# EAGLE design schematic (EAGLE 7.4.0)
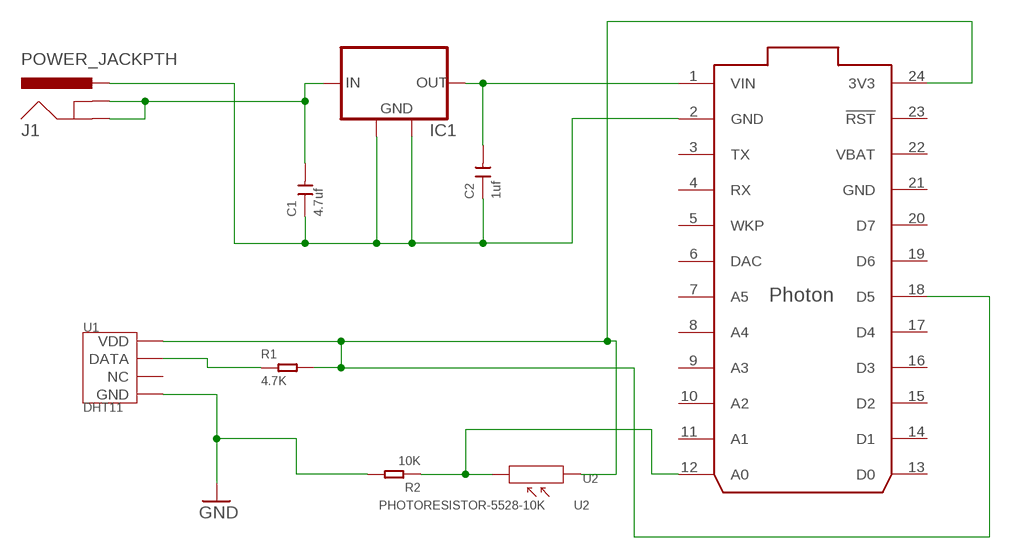
[diagram p0: schematic, sheet 1]

## Parts
C1  4.7uf  CERAMIC-4.7UF-50V-10%-X5R(1206)  [C1206]
C2  1uf  CERAMIC-1UF-25V-10%-X7R(0805)  [C0805]
IC1  MCP1825S-SOT223  [SOT223]
J1  POWER_JACKPTH  [POWER_JACK_PTH]
R1  4.7K  DIP-RES-4.7K-5%-1/4W(PR-D2.3XL6.5MM)  [PR-D2.3XL6.5MM]
R2  10K  DIP-RES-10K-5%-1/4W(PR-D2.3XL6.5MM)  [PR-D2.3XL6.5MM]
U1  DHT11  TEM-HUM-DHT11(4P-15.5X12.0MM)  [SNR4-2.54-15.5X12.0X5.5MM]
U2  PHOTORESISTOR-5528-10K  PHOTORESISTOR-5528-10K(2P-5.0X4.2MM)  [SNR2-3.0]
U$1  PHOTON_SMD  [PHOTON_SMD]

## Nets
GND: R2.2 U1.4(GND)
N$1: C1.1 C2.1 IC1.2(GND) IC1.4(GND) J1.PWR U$1.2(GND)
N$2: R1.1 U1.2(DATA)
N$4: C1.2 IC1.1(IN) J1.GND J1.GNDBREAK
N$5: C2.2 IC1.3(OUT) U$1.1(VIN)
N$8: R2.1 U2.2 U$1.12(A0)
VDD: R1.2 U1.1(VDD) U2.1 U$1.18(D5) U$1.24(3V3)
Unconnected: U1.3(NC) U$1.3(TX) U$1.4(RX) U$1.5(WKP) U$1.6(DAC) U$1.7(A5) U$1.8(A4) U$1.9(A3) U$1.10(A2) U$1.11(A1) U$1.13(D0) U$1.14(D1) U$1.15(D2) U$1.16(D3) U$1.17(D4) U$1.19(D6) U$1.20(D7) U$1.23(!RST) U$1.25(EN) U$1.26(!SETUP) U$1.27(RGB_RED) U$1.28(RGB_GREEN) U$1.29(RGB_BLUE) U$1.30(USB_D-) U$1.31(USB_D+)

## Power pins joined to a net without a drawn wire
GND: U$1.21(GND)
VBAT: U$1.22(VBAT)

## Library data of the parts
C1 = Seeed-OPL-Capacitor:CERAMIC-4.7UF-50V-10%-X5R(1206): 302010243; MPN: CC1206KKX5R9BB475
C2 = Seeed-OPL-Capacitor:CERAMIC-1UF-25V-10%-X7R(0805): 302010179; MPN: CC0805KKX7R8BB105
IC1 = Spark:MCP1825S: 500 mA, Low Voltage, Low Quiescent Current LDO Regulator
J1 = Spark:POWER_JACK: Power Jack This is the standard 5.5mm barrel jack for power. The PTH is the most common, proven, reliable, footprint. The Slot footprint only works if the mill layer is transmitted to the PCB fab house so be warned. Spark Fun Electronics SKU : PRT-00119 SMT: CONN-08106 Mating wall wart : TOL-00298 (and others)
R1 = Seeed-OPL-Resistor:DIP-RES-4.7K-5%-1/4W(PR-D2.3XL6.5MM): 301020012; MPN: FHCFR-1/4W-472J
R2 = Seeed-OPL-Resistor:DIP-RES-10K-5%-1/4W(PR-D2.3XL6.5MM): 301020001
U1 = Seeed-OPL-sensor:TEM-HUM-DHT11(4P-15.5X12.0MM): 314010000; MPN: DHT11
U2 = Seeed-OPL-sensor:PHOTORESISTOR-5528-10K(2P-5.0X4.2MM): 314020017; MPN: PHOTORESISTOR-5528-10K
U$1 = Spark:PHOTON_SMD: Photon (without headers) - designed to be surface mounted with 7 extra exposed pads on the bottom of the board which include, 3 RGB LED outputs, /SETUP, EN (3.3V SMPS enable input), USB D+ and USB D-.

## Board
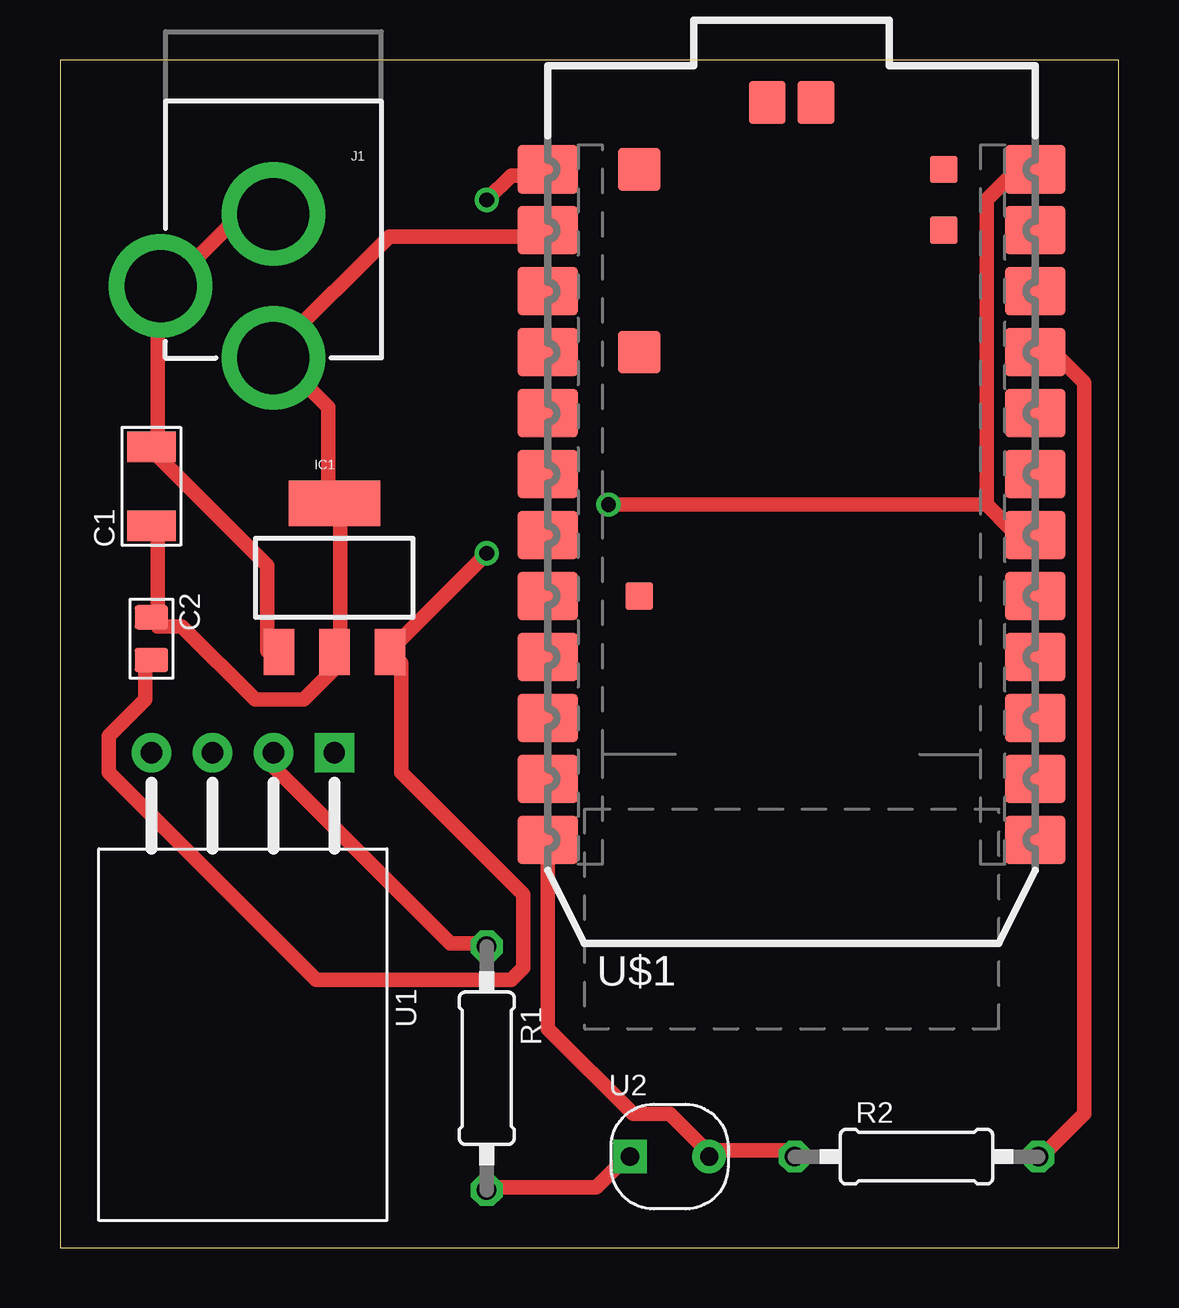
[diagram p1: board, top side]
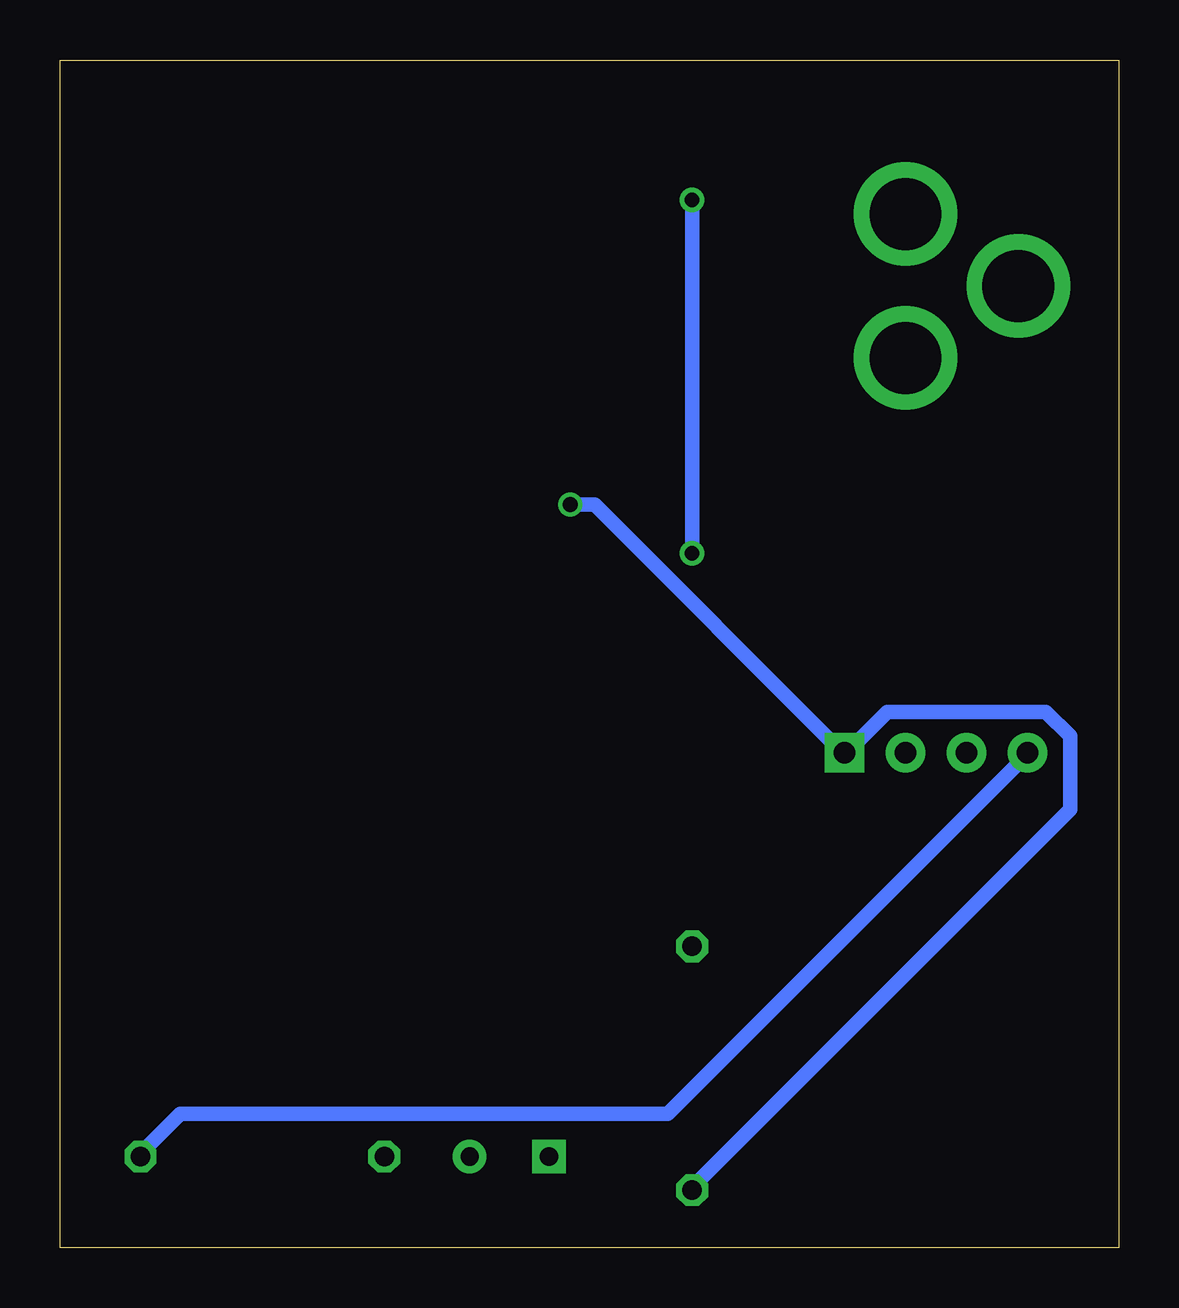
[diagram p2: board, bottom side, seen from below]

Size 44.12 x 49.52 mm. Coordinates in mm from the lower left corner, seen from the top.
Outline: 0,0 44.12,0 44.12,49.52 0,49.52 0,0
Copper layers (1*16): Top 0.035mm / dielectric 1.5mm / Bottom 0.035mm
Design rules "default *": minimum track width 24mil, minimum drill 24mil, track to track 16mil, track to pad 16mil, pad to pad 16mil, via to via 16mil, smd to smd 8mil, copper to edge 40mil, drill to drill 8mil, minimum pad ring 10mil, minimum via ring 8mil, stop-mask expansion 4mil, vias tented up to drill 0mil, thermal gap 10mil

### Footprints (pad centres in the part's own frame; a part is rotated, then mirrored left to right if it is on the bottom)
C1206 = smd 1.27 x 2.032: 1 -1.651,0; 2 1.651,0
C0805 = smd 1.397 x 1.016: 1 0,0.889; 2 0,-0.889
SOT223 = smd 1.27 x 1.905: 1 -2.311,-3.099; 2 0,-3.099; 3 2.311,-3.099 | smd 3.81 x 1.905: 4 0,3.099
POWER_JACK_PTH = drill 2.997 pad 4.318: GND 0,7.7; GNDBREAK 4.7,10.7; PWR 0,13.7
PR-D2.3XL6.5MM = drill 0.813 octagon: 1 -4.953,0; 2 5.207,0
SNR4-2.54-15.5X12.0X5.5MM = drill 0.889 pad 1.651 square: 1 -11.75,3.81 | drill 0.889 pad 1.651: 2 -11.75,1.27; 3 -11.75,-1.27; 4 -11.75,-3.81
SNR2-3.0 = drill 0.762 pad 1.397 square: 1 -1.651,0 | drill 0.762 pad 1.397: 2 1.651,0
PHOTON_SMD = smd 2.54 x 2.032: 1 0,32.258; 2 0,29.718; 3 0,27.178; 4 0,24.638; 5 0,22.098; 6 0,19.558; 7 0,17.018; 8 0,14.478; 9 0,11.938; 10 0,9.398; 11 0,6.858; 12 0,4.318; 13 20.32,4.318; 14 20.32,6.858; 15 20.32,9.398; 16 20.32,11.938; 17 20.32,14.478; 18 20.32,17.018; 19 20.32,19.558; 20 20.32,22.098; 21 20.32,24.638; 22 20.32,27.178; 23 20.32,29.718; 24 20.32,32.258 | smd 1.778 x 1.778: 25 3.81,32.258; 26 3.81,24.638 | smd 1.143 x 1.143: 27 3.81,14.478; 28 16.51,29.718; 29 16.51,32.258 | smd 1.524 x 1.778: 30 11.176,35.052; 31 9.144,35.052

### Placement (x,y rotation side)
C1  3.81,31.75 90 top
C2  3.81,25.4 0 top
IC1  11.43,27.94 0 top
J1  8.89,50.8 180 top
R1  17.78,7.62 270 top
R2  35.56,3.81 0 top
U1  7.62,8.89 270 top
U2  25.4,3.81 0 top
U$1  20.32,12.7 0 top

### Tracks (layer width: path | path; a pad name or v marks a point on that pad's centre or on a via)
GND
  Top 0.61: U$1.21 40.64,37.08 41.66,37.08 42.67,36.07 42.67,5.59 41.15,4.06 R2.2
  Bottom 0.61: U1.4 4.06,20.32 18.8,5.59 39.12,5.59 40.64,4.06 R2.2
N$1
  Top 0.61: C1.1 4.06,29.97 4.06,26.42 C2.1 4.06,25.91 5.08,25.91 8.13,22.86 10.16,22.86 11.68,24.38 IC1.2 11.68,24.89 11.68,30.99 IC1.4 11.18,31.5 11.18,35.05 9.14,37.08 J1.PWR 9.14,37.59 13.72,42.16 20.32,42.16 U$1.2
N$2
  Top 0.61: R1.1 17.78,12.7 16.26,12.7 8.64,20.32 U1.2
N$4
  Top 0.61: IC1.1 8.64,24.89 8.64,28.45 4.06,33.02 C1.2 4.06,33.53 4.06,39.62 J1.GNDBREAK 4.57,40.13 7.11,42.67 8.64,42.67 J1.GND
N$5  (via drill 0.61)
  Top 0.61: C2.2 3.56,24.38 3.56,22.86 2.03,21.34 2.03,19.81 10.67,11.18 18.8,11.18 19.3,11.68 19.3,14.73 14.22,19.81 14.22,24.38 IC1.3 13.72,24.89 v17.78,28.96 | v17.78,43.69 18.8,44.7 20.32,44.7 U$1.1
  Bottom 0.61: v17.78,28.96 v17.78,43.69
N$8
  Top 0.61: U$1.12 20.32,9.14 23.88,5.59 25.4,5.59 26.92,4.06 U2.2 27.43,4.06 30.48,4.06 R2.1
VDD  (via drill 0.61)
  Top 0.61: 38.61,30.99 39.62,29.97 40.64,29.97 U$1.18 | 38.61,30.99 38.61,43.69 39.62,44.7 40.64,44.7 U$1.24 | R1.2 17.78,2.54 22.35,2.54 23.37,3.56 U2.1 | v22.86,30.99 38.61,30.99
  Bottom 0.61: R1.2 17.78,2.54 2.03,18.29 2.03,21.34 3.05,22.35 9.65,22.35 11.18,20.83 U1.1 11.68,20.83 21.84,30.99 v22.86,30.99